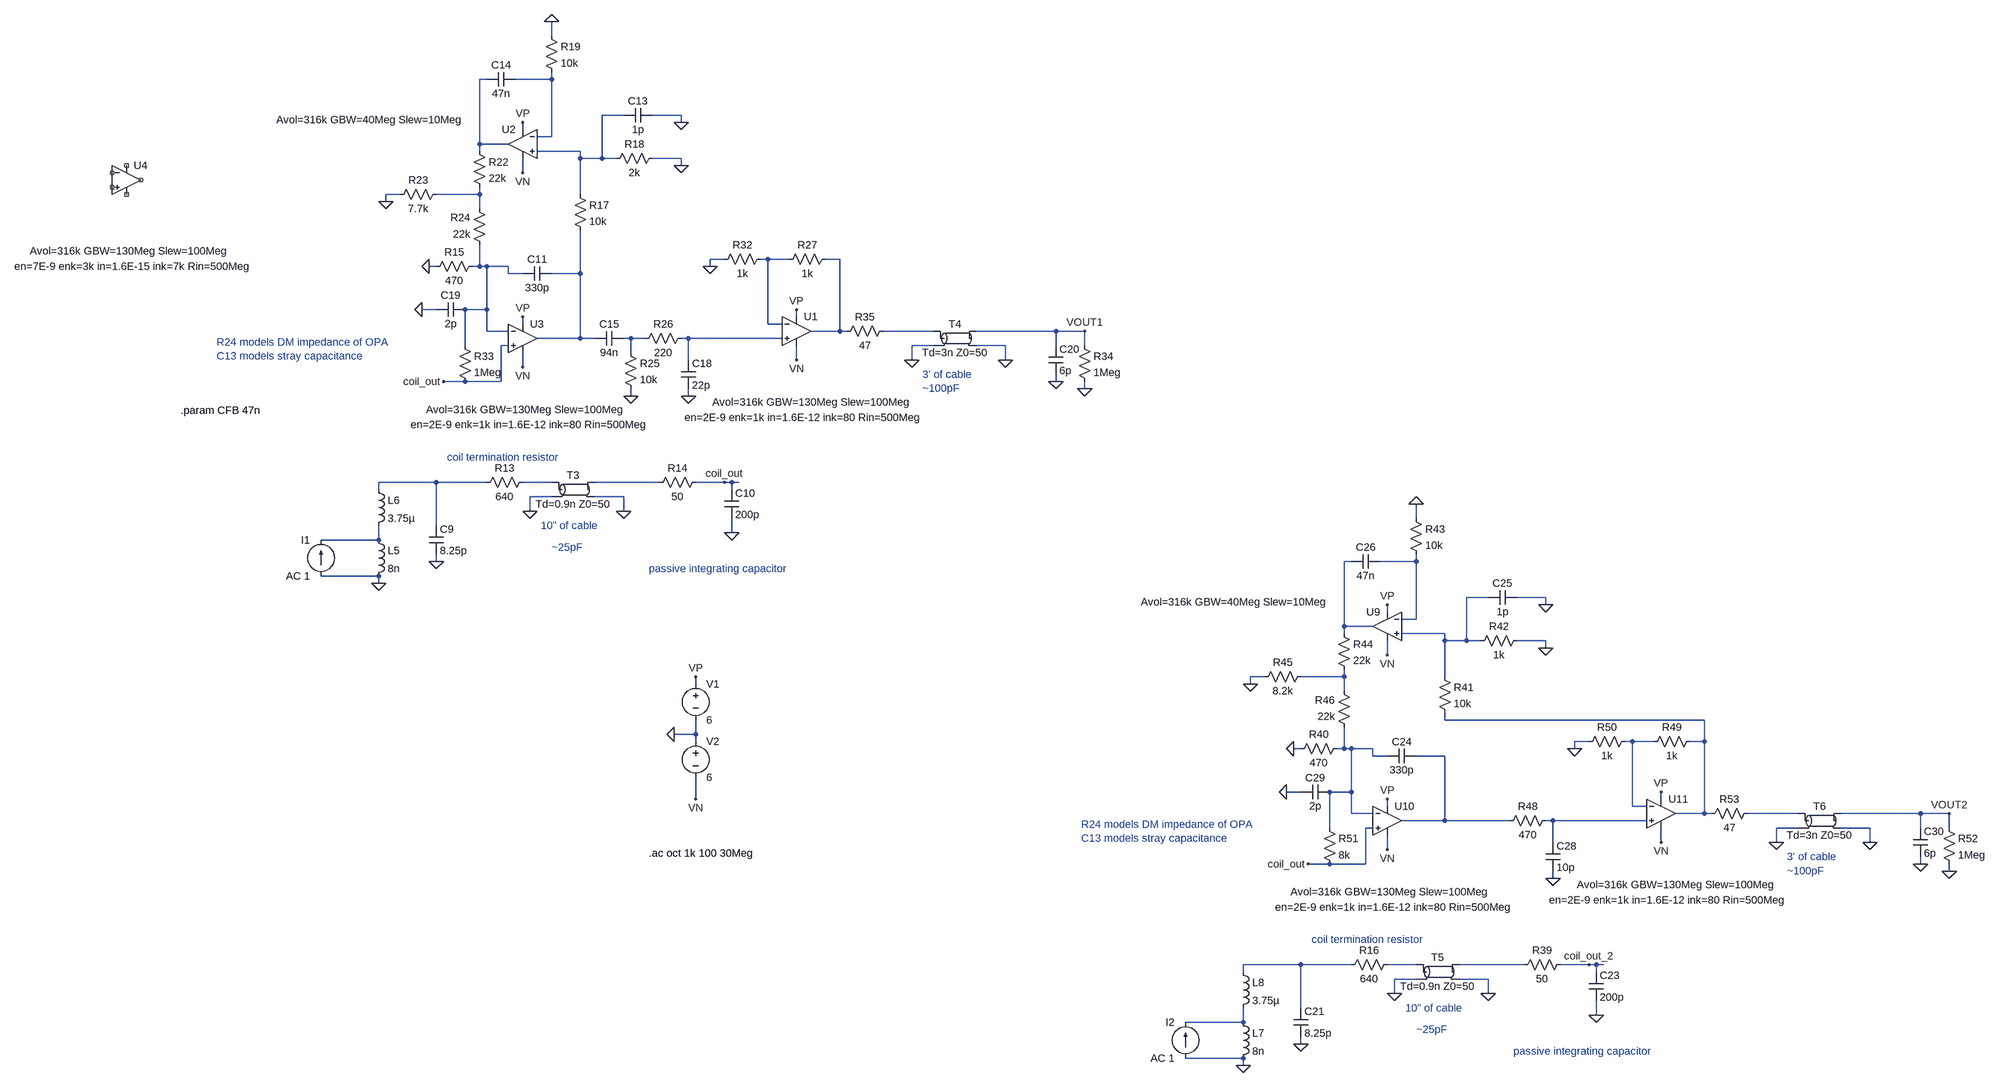
[diagram p0: schematic amp_sim_v2.asc]
amp_sim_v2.asc, the LTspice schematic file:
Version 4
SHEET 1 4392 1112
WIRE 1200 -2560 1200 -2592
WIRE 1056 -2464 1040 -2464
WIRE 1200 -2464 1200 -2480
WIRE 1200 -2464 1120 -2464
WIRE 1360 -2384 1312 -2384
WIRE 1488 -2384 1424 -2384
WIRE 1488 -2368 1488 -2384
WIRE 1136 -2352 1136 -2368
WIRE 1200 -2336 1200 -2464
WIRE 1200 -2336 1168 -2336
WIRE 1040 -2320 1040 -2464
WIRE 1104 -2320 1040 -2320
WIRE 1040 -2304 1040 -2320
WIRE 1264 -2304 1168 -2304
WIRE 1264 -2288 1264 -2304
WIRE 1312 -2288 1312 -2384
WIRE 1312 -2288 1264 -2288
WIRE 1344 -2288 1312 -2288
WIRE 1488 -2288 1424 -2288
WIRE 1488 -2272 1488 -2288
WIRE 1136 -2256 1136 -2288
WIRE 864 -2208 832 -2208
WIRE 1040 -2208 1040 -2224
WIRE 1040 -2208 944 -2208
WIRE 1264 -2208 1264 -2288
WIRE 832 -2192 832 -2208
WIRE 1040 -2176 1040 -2208
WIRE 1584 -2064 1552 -2064
WIRE 1680 -2064 1664 -2064
WIRE 1728 -2064 1680 -2064
WIRE 1840 -2064 1808 -2064
WIRE 944 -2048 928 -2048
WIRE 1040 -2048 1040 -2096
WIRE 1040 -2048 1024 -2048
WIRE 1056 -2048 1040 -2048
WIRE 1104 -2048 1056 -2048
WIRE 1552 -2048 1552 -2064
WIRE 1104 -2032 1104 -2048
WIRE 1136 -2032 1104 -2032
WIRE 1264 -2032 1264 -2128
WIRE 1264 -2032 1200 -2032
WIRE 944 -1952 912 -1952
WIRE 1056 -1952 1056 -2048
WIRE 1056 -1952 1008 -1952
WIRE 1744 -1936 1744 -1952
WIRE 1136 -1920 1136 -1936
WIRE 1680 -1920 1680 -2064
WIRE 1712 -1920 1680 -1920
WIRE 1056 -1904 1056 -1952
WIRE 1104 -1904 1056 -1904
WIRE 1840 -1904 1840 -2064
WIRE 1840 -1904 1776 -1904
WIRE 1856 -1904 1840 -1904
WIRE 2048 -1904 1936 -1904
WIRE 2320 -1904 2144 -1904
WIRE 2384 -1904 2320 -1904
WIRE 1264 -1888 1264 -2032
WIRE 1264 -1888 1168 -1888
WIRE 1296 -1888 1264 -1888
WIRE 1376 -1888 1360 -1888
WIRE 1408 -1888 1376 -1888
WIRE 1504 -1888 1488 -1888
WIRE 1712 -1888 1504 -1888
WIRE 1008 -1872 1008 -1952
WIRE 1104 -1872 1088 -1872
WIRE 2048 -1872 2000 -1872
WIRE 2208 -1872 2144 -1872
WIRE 2320 -1872 2320 -1904
WIRE 2384 -1872 2384 -1904
WIRE 1376 -1856 1376 -1888
WIRE 1504 -1840 1504 -1888
WIRE 1744 -1840 1744 -1872
WIRE 2000 -1840 2000 -1872
WIRE 2208 -1840 2208 -1872
WIRE 1136 -1824 1136 -1856
WIRE 1008 -1792 960 -1792
WIRE 1088 -1792 1088 -1872
WIRE 1088 -1792 1008 -1792
WIRE 2320 -1792 2320 -1808
WIRE 2384 -1776 2384 -1792
WIRE 1376 -1760 1376 -1776
WIRE 1504 -1760 1504 -1776
WIRE 944 -1568 816 -1568
WIRE 1056 -1568 944 -1568
WIRE 1200 -1568 1136 -1568
WIRE 1440 -1568 1296 -1568
WIRE 1584 -1568 1520 -1568
WIRE 1600 -1568 1584 -1568
WIRE 1616 -1568 1600 -1568
WIRE 816 -1552 816 -1568
WIRE 1600 -1552 1600 -1568
WIRE 1200 -1536 1152 -1536
WIRE 1360 -1536 1296 -1536
WIRE 1152 -1504 1152 -1536
WIRE 1360 -1504 1360 -1536
WIRE 3120 -1488 3120 -1520
WIRE 944 -1472 944 -1568
WIRE 1600 -1456 1600 -1488
WIRE 816 -1440 816 -1472
WIRE 816 -1440 688 -1440
WIRE 944 -1392 944 -1408
WIRE 2976 -1392 2960 -1392
WIRE 3120 -1392 3120 -1408
WIRE 3120 -1392 3040 -1392
WIRE 816 -1360 688 -1360
WIRE 816 -1344 816 -1360
WIRE 3280 -1312 3232 -1312
WIRE 3408 -1312 3344 -1312
WIRE 3408 -1296 3408 -1312
WIRE 3056 -1280 3056 -1296
WIRE 3120 -1264 3120 -1392
WIRE 3120 -1264 3088 -1264
WIRE 2960 -1248 2960 -1392
WIRE 3024 -1248 2960 -1248
WIRE 2960 -1232 2960 -1248
WIRE 3184 -1232 3088 -1232
WIRE 3184 -1216 3184 -1232
WIRE 3232 -1216 3232 -1312
WIRE 3232 -1216 3184 -1216
WIRE 3264 -1216 3232 -1216
WIRE 3408 -1216 3344 -1216
WIRE 3408 -1200 3408 -1216
WIRE 3056 -1184 3056 -1216
WIRE 2784 -1136 2752 -1136
WIRE 2960 -1136 2960 -1152
WIRE 2960 -1136 2864 -1136
WIRE 3184 -1136 3184 -1216
WIRE 1520 -1120 1520 -1136
WIRE 2752 -1120 2752 -1136
WIRE 2960 -1104 2960 -1136
WIRE 3184 -1040 3184 -1056
WIRE 3760 -1040 3184 -1040
WIRE 1520 -1008 1520 -1040
WIRE 1520 -1008 1472 -1008
WIRE 1520 -992 1520 -1008
WIRE 3504 -992 3472 -992
WIRE 3600 -992 3584 -992
WIRE 3648 -992 3600 -992
WIRE 3760 -992 3760 -1040
WIRE 3760 -992 3728 -992
WIRE 2864 -976 2848 -976
WIRE 2960 -976 2960 -1024
WIRE 2960 -976 2944 -976
WIRE 2976 -976 2960 -976
WIRE 3024 -976 2976 -976
WIRE 3472 -976 3472 -992
WIRE 3024 -960 3024 -976
WIRE 3056 -960 3024 -960
WIRE 3184 -960 3120 -960
WIRE 2864 -880 2832 -880
WIRE 2976 -880 2976 -976
WIRE 2976 -880 2928 -880
WIRE 1520 -864 1520 -912
WIRE 3664 -864 3664 -880
WIRE 3056 -848 3056 -864
WIRE 3600 -848 3600 -992
WIRE 3632 -848 3600 -848
WIRE 2976 -832 2976 -880
WIRE 3024 -832 2976 -832
WIRE 3760 -832 3760 -992
WIRE 3760 -832 3696 -832
WIRE 3776 -832 3760 -832
WIRE 3968 -832 3856 -832
WIRE 4240 -832 4064 -832
WIRE 4304 -832 4240 -832
WIRE 3184 -816 3184 -960
WIRE 3184 -816 3088 -816
WIRE 3328 -816 3184 -816
WIRE 3424 -816 3408 -816
WIRE 3632 -816 3424 -816
WIRE 2928 -800 2928 -880
WIRE 3024 -800 3008 -800
WIRE 3968 -800 3920 -800
WIRE 4128 -800 4064 -800
WIRE 4240 -800 4240 -832
WIRE 4304 -800 4304 -832
WIRE 3424 -768 3424 -816
WIRE 3664 -768 3664 -800
WIRE 3920 -768 3920 -800
WIRE 4128 -768 4128 -800
WIRE 3056 -752 3056 -784
WIRE 2928 -720 2880 -720
WIRE 3008 -720 3008 -800
WIRE 3008 -720 2928 -720
WIRE 4240 -720 4240 -736
WIRE 4304 -704 4304 -720
WIRE 3424 -688 3424 -704
WIRE 2864 -496 2736 -496
WIRE 2976 -496 2864 -496
WIRE 3120 -496 3056 -496
WIRE 3360 -496 3216 -496
WIRE 3504 -496 3440 -496
WIRE 3520 -496 3504 -496
WIRE 3536 -496 3520 -496
WIRE 2736 -480 2736 -496
WIRE 3520 -480 3520 -496
WIRE 3120 -464 3072 -464
WIRE 3280 -464 3216 -464
WIRE 3072 -432 3072 -464
WIRE 3280 -432 3280 -464
WIRE 2864 -400 2864 -496
WIRE 3520 -384 3520 -416
WIRE 2736 -368 2736 -400
WIRE 2736 -368 2608 -368
WIRE 2864 -320 2864 -336
WIRE 2736 -288 2608 -288
WIRE 2736 -272 2736 -288
FLAG 1472 -1008 0
FLAG 1520 -1136 VP
FLAG 1520 -864 VN
FLAG 944 -1392 0
FLAG 816 -1344 0
FLAG 1152 -1504 0
FLAG 1360 -1504 0
FLAG 1600 -1456 0
FLAG 1584 -1568 coil_out
FLAG 1136 -1936 VP
FLAG 1136 -1824 VN
FLAG 928 -2048 0
FLAG 1136 -2368 VP
FLAG 1136 -2256 VN
FLAG 1488 -2272 0
FLAG 1488 -2368 0
FLAG 1200 -2592 0
FLAG 832 -2192 0
FLAG 1744 -1952 VP
FLAG 1744 -1840 VN
FLAG 1504 -1760 0
FLAG 1376 -1760 0
FLAG 1552 -2048 0
FLAG 2384 -1904 VOUT1
FLAG 960 -1792 coil_out
FLAG 912 -1952 0
FLAG 2000 -1840 0
FLAG 2208 -1840 0
FLAG 2320 -1792 0
FLAG 2384 -1776 0
FLAG 2864 -320 0
FLAG 2736 -272 0
FLAG 3072 -432 0
FLAG 3280 -432 0
FLAG 3520 -384 0
FLAG 3504 -496 coil_out_2
FLAG 3056 -864 VP
FLAG 3056 -752 VN
FLAG 2848 -976 0
FLAG 3056 -1296 VP
FLAG 3056 -1184 VN
FLAG 3408 -1200 0
FLAG 3408 -1296 0
FLAG 3120 -1520 0
FLAG 2752 -1120 0
FLAG 3664 -880 VP
FLAG 3664 -768 VN
FLAG 3424 -688 0
FLAG 3472 -976 0
FLAG 4304 -832 VOUT2
FLAG 2880 -720 coil_out
FLAG 2832 -880 0
FLAG 3920 -768 0
FLAG 4128 -768 0
FLAG 4240 -720 0
FLAG 4304 -704 0
SYMBOL voltage 1520 -1136 R0
WINDOW 123 0 0 Left 0
WINDOW 39 0 0 Left 0
SYMATTR InstName V1
SYMATTR Value 6
SYMBOL voltage 1520 -1008 R0
WINDOW 123 0 0 Left 0
WINDOW 39 0 0 Left 0
SYMATTR InstName V2
SYMATTR Value 6
SYMBOL ind 800 -1456 R0
SYMATTR InstName L5
SYMATTR Value 8n
SYMATTR SpiceLine Rser=0
SYMBOL ind 800 -1568 R0
SYMATTR InstName L6
SYMATTR Value 3.75µ
SYMBOL cap 928 -1472 R0
SYMATTR InstName C9
SYMATTR Value 8.25p
SYMBOL res 1152 -1584 R90
WINDOW 0 0 56 VBottom 2
WINDOW 3 32 56 VTop 2
SYMATTR InstName R13
SYMATTR Value 640
SYMBOL res 1536 -1584 R90
WINDOW 0 0 56 VBottom 2
WINDOW 3 32 56 VTop 2
SYMATTR InstName R14
SYMATTR Value 50
SYMBOL tline 1248 -1552 R0
SYMATTR InstName T3
SYMATTR Value Td=0.9n Z0=50
SYMBOL cap 1584 -1552 R0
SYMATTR InstName C10
SYMATTR Value 200p
SYMBOL res 928 -2032 R270
WINDOW 0 32 56 VTop 2
WINDOW 3 0 56 VBottom 2
SYMATTR InstName R15
SYMATTR Value 470
SYMBOL cap 1200 -2048 R90
WINDOW 0 0 32 VBottom 2
WINDOW 3 32 32 VTop 2
SYMATTR InstName C11
SYMATTR Value 330p
SYMBOL res 1248 -2224 R0
SYMATTR InstName R17
SYMATTR Value 10k
SYMBOL res 1440 -2304 R90
WINDOW 0 0 56 VBottom 2
WINDOW 3 32 56 VTop 2
SYMATTR InstName R18
SYMATTR Value 2k
SYMBOL cap 1424 -2400 R90
WINDOW 0 0 32 VBottom 2
WINDOW 3 32 32 VTop 2
SYMATTR InstName C13
SYMATTR Value 1p
SYMBOL res 1184 -2576 R0
SYMATTR InstName R19
SYMATTR Value 10k
SYMBOL cap 1120 -2480 R90
WINDOW 0 0 32 VBottom 2
WINDOW 3 32 32 VTop 2
SYMATTR InstName C14
SYMATTR Value 47n
SYMBOL res 1024 -2320 R0
SYMATTR InstName R22
SYMATTR Value 22k
SYMBOL res 960 -2224 R90
WINDOW 0 0 56 VBottom 2
WINDOW 3 32 56 VTop 2
SYMATTR InstName R23
SYMATTR Value 7.7k
SYMBOL res 1056 -2080 R180
WINDOW 0 36 76 Left 2
WINDOW 3 36 40 Left 2
SYMATTR InstName R24
SYMATTR Value 22k
SYMBOL cap 1360 -1904 R90
WINDOW 0 0 32 VBottom 2
WINDOW 3 32 32 VTop 2
SYMATTR InstName C15
SYMATTR Value 94n
SYMBOL res 1360 -1872 R0
SYMATTR InstName R25
SYMATTR Value 10k
SYMBOL res 1504 -1904 R90
WINDOW 0 0 56 VBottom 2
WINDOW 3 32 56 VTop 2
SYMATTR InstName R26
SYMATTR Value 220
SYMBOL cap 1488 -1840 R0
SYMATTR InstName C18
SYMATTR Value 22p
SYMBOL res 1824 -2080 R90
WINDOW 0 0 56 VBottom 2
WINDOW 3 32 56 VTop 2
SYMATTR InstName R27
SYMATTR Value 1k
SYMBOL res 1680 -2080 R90
WINDOW 0 0 56 VBottom 2
WINDOW 3 32 56 VTop 2
SYMATTR InstName R32
SYMATTR Value 1k
SYMBOL OpAmps\\UniversalOpamp2 1136 -2320 M0
WINDOW 123 135 -54 Left 2
SYMATTR Value2 Avol=316k GBW=40Meg Slew=10Meg
SYMATTR InstName U2
SYMATTR SpiceLine2 en=1E-9 enk=25 in=0.04E-12 ink=2k Rin=500Meg
SYMBOL cap 1008 -1968 R90
WINDOW 0 0 32 VBottom 2
WINDOW 3 32 32 VTop 2
SYMATTR InstName C19
SYMATTR Value 2p
SYMBOL res 992 -1888 R0
SYMATTR InstName R33
SYMATTR Value 1Meg
SYMBOL OpAmps\\UniversalOpamp2 1136 -1888 R0
WINDOW 123 -215 158 Left 2
WINDOW 40 -249 192 Left 2
SYMATTR Value2 Avol=316k GBW=130Meg Slew=100Meg
SYMATTR SpiceLine2 en=2E-9 enk=1k in=1.6E-12 ink=80 Rin=500Meg
SYMATTR InstName U3
SYMATTR SpiceLine ilimit=80m rail=0 Vos=0 phimargin=45
SYMBOL tline 2096 -1888 R0
SYMATTR InstName T4
SYMATTR Value Td=3n Z0=50
SYMBOL res 2368 -1888 R0
SYMATTR InstName R34
SYMATTR Value 1Meg
SYMBOL cap 2304 -1872 R0
SYMATTR InstName C20
SYMATTR Value 6p
SYMBOL res 1952 -1920 R90
WINDOW 0 0 56 VBottom 2
WINDOW 3 32 56 VTop 2
SYMATTR InstName R35
SYMATTR Value 47
SYMBOL OpAmps\\UniversalOpamp2 1744 -1904 R0
WINDOW 123 -187 158 Left 2
WINDOW 40 -249 192 Left 2
SYMATTR Value2 Avol=316k GBW=130Meg Slew=100Meg
SYMATTR SpiceLine2 en=2E-9 enk=1k in=1.6E-12 ink=80 Rin=500Meg
SYMATTR InstName U1
SYMATTR SpiceLine ilimit=80m rail=0 Vos=0 phimargin=45
SYMBOL ind 2720 -384 R0
SYMATTR InstName L7
SYMATTR Value 8n
SYMATTR SpiceLine Rser=0
SYMBOL ind 2720 -496 R0
SYMATTR InstName L8
SYMATTR Value 3.75µ
SYMBOL cap 2848 -400 R0
SYMATTR InstName C21
SYMATTR Value 8.25p
SYMBOL res 3072 -512 R90
WINDOW 0 0 56 VBottom 2
WINDOW 3 32 56 VTop 2
SYMATTR InstName R16
SYMATTR Value 640
SYMBOL res 3456 -512 R90
WINDOW 0 0 56 VBottom 2
WINDOW 3 32 56 VTop 2
SYMATTR InstName R39
SYMATTR Value 50
SYMBOL tline 3168 -480 R0
SYMATTR InstName T5
SYMATTR Value Td=0.9n Z0=50
SYMBOL cap 3504 -480 R0
SYMATTR InstName C23
SYMATTR Value 200p
SYMBOL res 2848 -960 R270
WINDOW 0 32 56 VTop 2
WINDOW 3 0 56 VBottom 2
SYMATTR InstName R40
SYMATTR Value 470
SYMBOL cap 3120 -976 R90
WINDOW 0 0 32 VBottom 2
WINDOW 3 32 32 VTop 2
SYMATTR InstName C24
SYMATTR Value 330p
SYMBOL res 3168 -1152 R0
SYMATTR InstName R41
SYMATTR Value 10k
SYMBOL res 3360 -1232 R90
WINDOW 0 0 56 VBottom 2
WINDOW 3 32 56 VTop 2
SYMATTR InstName R42
SYMATTR Value 1k
SYMBOL cap 3344 -1328 R90
WINDOW 0 0 32 VBottom 2
WINDOW 3 32 32 VTop 2
SYMATTR InstName C25
SYMATTR Value 1p
SYMBOL res 3104 -1504 R0
SYMATTR InstName R43
SYMATTR Value 10k
SYMBOL cap 3040 -1408 R90
WINDOW 0 0 32 VBottom 2
WINDOW 3 32 32 VTop 2
SYMATTR InstName C26
SYMATTR Value 47n
SYMBOL res 2944 -1248 R0
SYMATTR InstName R44
SYMATTR Value 22k
SYMBOL res 2880 -1152 R90
WINDOW 0 0 56 VBottom 2
WINDOW 3 32 56 VTop 2
SYMATTR InstName R45
SYMATTR Value 8.2k
SYMBOL res 2976 -1008 R180
WINDOW 0 36 76 Left 2
WINDOW 3 36 40 Left 2
SYMATTR InstName R46
SYMATTR Value 22k
SYMBOL res 3424 -832 R90
WINDOW 0 0 56 VBottom 2
WINDOW 3 32 56 VTop 2
SYMATTR InstName R48
SYMATTR Value 470
SYMBOL cap 3408 -768 R0
SYMATTR InstName C28
SYMATTR Value 10p
SYMBOL res 3744 -1008 R90
WINDOW 0 0 56 VBottom 2
WINDOW 3 32 56 VTop 2
SYMATTR InstName R49
SYMATTR Value 1k
SYMBOL res 3600 -1008 R90
WINDOW 0 0 56 VBottom 2
WINDOW 3 32 56 VTop 2
SYMATTR InstName R50
SYMATTR Value 1k
SYMBOL OpAmps\\UniversalOpamp2 3056 -1248 M0
WINDOW 123 135 -54 Left 2
SYMATTR Value2 Avol=316k GBW=40Meg Slew=10Meg
SYMATTR InstName U9
SYMATTR SpiceLine2 en=1E-9 enk=25 in=0.04E-12 ink=2k Rin=500Meg
SYMBOL cap 2928 -896 R90
WINDOW 0 0 32 VBottom 2
WINDOW 3 32 32 VTop 2
SYMATTR InstName C29
SYMATTR Value 2p
SYMBOL res 2912 -816 R0
SYMATTR InstName R51
SYMATTR Value 8k
SYMBOL OpAmps\\UniversalOpamp2 3056 -816 R0
WINDOW 123 -215 158 Left 2
WINDOW 40 -249 192 Left 2
SYMATTR Value2 Avol=316k GBW=130Meg Slew=100Meg
SYMATTR SpiceLine2 en=2E-9 enk=1k in=1.6E-12 ink=80 Rin=500Meg
SYMATTR InstName U10
SYMATTR SpiceLine ilimit=80m rail=0 Vos=0 phimargin=45
SYMBOL tline 4016 -816 R0
SYMATTR InstName T6
SYMATTR Value Td=3n Z0=50
SYMBOL res 4288 -816 R0
SYMATTR InstName R52
SYMATTR Value 1Meg
SYMBOL cap 4224 -800 R0
SYMATTR InstName C30
SYMATTR Value 6p
SYMBOL res 3872 -848 R90
WINDOW 0 0 56 VBottom 2
WINDOW 3 32 56 VTop 2
SYMATTR InstName R53
SYMATTR Value 47
SYMBOL OpAmps\\UniversalOpamp2 3664 -832 R0
WINDOW 123 -187 158 Left 2
WINDOW 40 -249 192 Left 2
SYMATTR Value2 Avol=316k GBW=130Meg Slew=100Meg
SYMATTR SpiceLine2 en=2E-9 enk=1k in=1.6E-12 ink=80 Rin=500Meg
SYMATTR InstName U11
SYMATTR SpiceLine ilimit=80m rail=0 Vos=0 phimargin=45
SYMBOL current 688 -1360 R180
WINDOW 0 24 80 Left 2
WINDOW 3 24 0 Left 2
WINDOW 123 0 0 Left 0
WINDOW 39 0 0 Left 0
SYMATTR InstName I1
SYMATTR Value AC 1
SYMBOL current 2608 -288 R180
WINDOW 0 24 80 Left 2
WINDOW 3 24 0 Left 2
WINDOW 123 0 0 Left 0
WINDOW 39 0 0 Left 0
SYMATTR InstName I2
SYMATTR Value AC 1
SYMBOL OpAmps\\UniversalOpamp2 256 -2240 R0
WINDOW 123 -215 158 Left 2
WINDOW 40 -249 192 Left 2
SYMATTR Value2 Avol=316k GBW=130Meg Slew=100Meg
SYMATTR SpiceLine2 en=7E-9 enk=3k in=1.6E-15 ink=7k Rin=500Meg
SYMATTR InstName U4
SYMATTR SpiceLine ilimit=80m rail=0 Vos=0 phimargin=45
TEXT 1416 -744 Left 2 !.ac oct 1k 100 30Meg
TEXT 1176 -1472 Left 2 ;10" of cable
TEXT 968 -1624 Left 2 ;coil termination resistor
TEXT 1416 -1376 Left 2 ;passive integrating capacitor
TEXT 1200 -1424 Left 2 ;~25pF
TEXT 456 -1880 Left 2 ;R24 models DM impedance of OPA\nC13 models stray capacitance
TEXT 2024 -1808 Left 2 ;3' of cable\n~100pF
TEXT 376 -1728 Left 2 !.param CFB 47n
TEXT 3096 -400 Left 2 ;10" of cable
TEXT 2888 -552 Left 2 ;coil termination resistor
TEXT 3336 -304 Left 2 ;passive integrating capacitor
TEXT 3120 -352 Left 2 ;~25pF
TEXT 2376 -808 Left 2 ;R24 models DM impedance of OPA\nC13 models stray capacitance
TEXT 3944 -736 Left 2 ;3' of cable\n~100pF

The netlist it stands for:
* amp_sim_v2.asc
V1 VP 0 6
V2 0 VN 6
L5 N015 0 8n Rser=0
L6 N012 N015 3.75µ
C9 N012 0 8.25p
R13 N013 N012 640
R14 coil_out N014 50
T3 N013 0 N014 0 Td=0.9n Z0=50
C10 coil_out 0 200p
R15 0 N007 470
C11 N008 N007 330p
R17 N003 N008 10k
R18 0 N003 2k
C13 0 N003 1p
R19 0 N002 10k
C14 N002 N001 47n
R22 N001 N004 22k
R23 N004 0 7.7k
R24 N007 N004 22k
C15 N010 N008 94n
R25 N010 0 10k
R26 N011 N010 220
C18 N011 0 22p
R27 N006 N005 1k
R32 N005 0 1k
XU2 N003 N002 VP VN N001 level.2 Avol=316k GBW=40Meg Slew=10Meg ilimit=25m rail=0 Vos=0 phimargin=45 en=1E-9 enk=25 in=0.04E-12 ink=2k Rin=500Meg  ; pins IN+ IN- V+ V- OUT
C19 N007 0 2p
R33 N007 coil_out 1Meg
XU3 coil_out N007 VP VN N008 level.2 Avol=316k GBW=130Meg Slew=100Meg ilimit=80m rail=0 Vos=0 phimargin=45 en=2E-9 enk=1k in=1.6E-12 ink=80 Rin=500Meg  ; pins IN+ IN- V+ V- OUT
T4 N009 0 VOUT1 0 Td=3n Z0=50
R34 VOUT1 0 1Meg
C20 VOUT1 0 6p
R35 N009 N006 47
XU1 N011 N005 VP VN N006 level.2 Avol=316k GBW=130Meg Slew=100Meg ilimit=80m rail=0 Vos=0 phimargin=45 en=2E-9 enk=1k in=1.6E-12 ink=80 Rin=500Meg  ; pins IN+ IN- V+ V- OUT
L7 N029 0 8n Rser=0
L8 N026 N029 3.75µ
C21 N026 0 8.25p
R16 N027 N026 640
R39 coil_out_2 N028 50
T5 N027 0 N028 0 Td=0.9n Z0=50
C23 coil_out_2 0 200p
R40 0 N022 470
C24 N023 N022 330p
R41 N018 N020 10k
R42 0 N018 1k
C25 0 N018 1p
R43 0 N017 10k
C26 N017 N016 47n
R44 N016 N019 22k
R45 N019 0 8.2k
R46 N022 N019 22k
R48 N025 N023 470
C28 N025 0 10p
R49 N020 N021 1k
R50 N021 0 1k
XU9 N018 N017 VP VN N016 level.2 Avol=316k GBW=40Meg Slew=10Meg ilimit=25m rail=0 Vos=0 phimargin=45 en=1E-9 enk=25 in=0.04E-12 ink=2k Rin=500Meg  ; pins IN+ IN- V+ V- OUT
C29 N022 0 2p
R51 N022 coil_out 8k
XU10 coil_out N022 VP VN N023 level.2 Avol=316k GBW=130Meg Slew=100Meg ilimit=80m rail=0 Vos=0 phimargin=45 en=2E-9 enk=1k in=1.6E-12 ink=80 Rin=500Meg  ; pins IN+ IN- V+ V- OUT
T6 N024 0 VOUT2 0 Td=3n Z0=50
R52 VOUT2 0 1Meg
C30 VOUT2 0 6p
R53 N024 N020 47
XU11 N025 N021 VP VN N020 level.2 Avol=316k GBW=130Meg Slew=100Meg ilimit=80m rail=0 Vos=0 phimargin=45 en=2E-9 enk=1k in=1.6E-12 ink=80 Rin=500Meg  ; pins IN+ IN- V+ V- OUT
I1 0 N015 AC 1
I2 0 N029 AC 1
XU4 NC_01 NC_02 NC_03 NC_04 NC_05 level.2 Avol=316k GBW=130Meg Slew=100Meg ilimit=80m rail=0 Vos=0 phimargin=45 en=7E-9 enk=3k in=1.6E-15 ink=7k Rin=500Meg  ; pins IN+ IN- V+ V- OUT
.ac oct 1k 100 30Meg
* 10" of cable
* coil termination resistor
* passive integrating capacitor
* ~25pF
* R24 models DM impedance of OPA
* C13 models stray capacitance
* 3' of cable
* ~100pF
.param CFB 47n
* 10" of cable
* coil termination resistor
* passive integrating capacitor
* ~25pF
* R24 models DM impedance of OPA
* C13 models stray capacitance
* 3' of cable
* ~100pF
.lib UniversalOpamps2.sub
.backanno
.end